# EAGLE board control_board_v006_Rev5 (EAGLE 6.2)
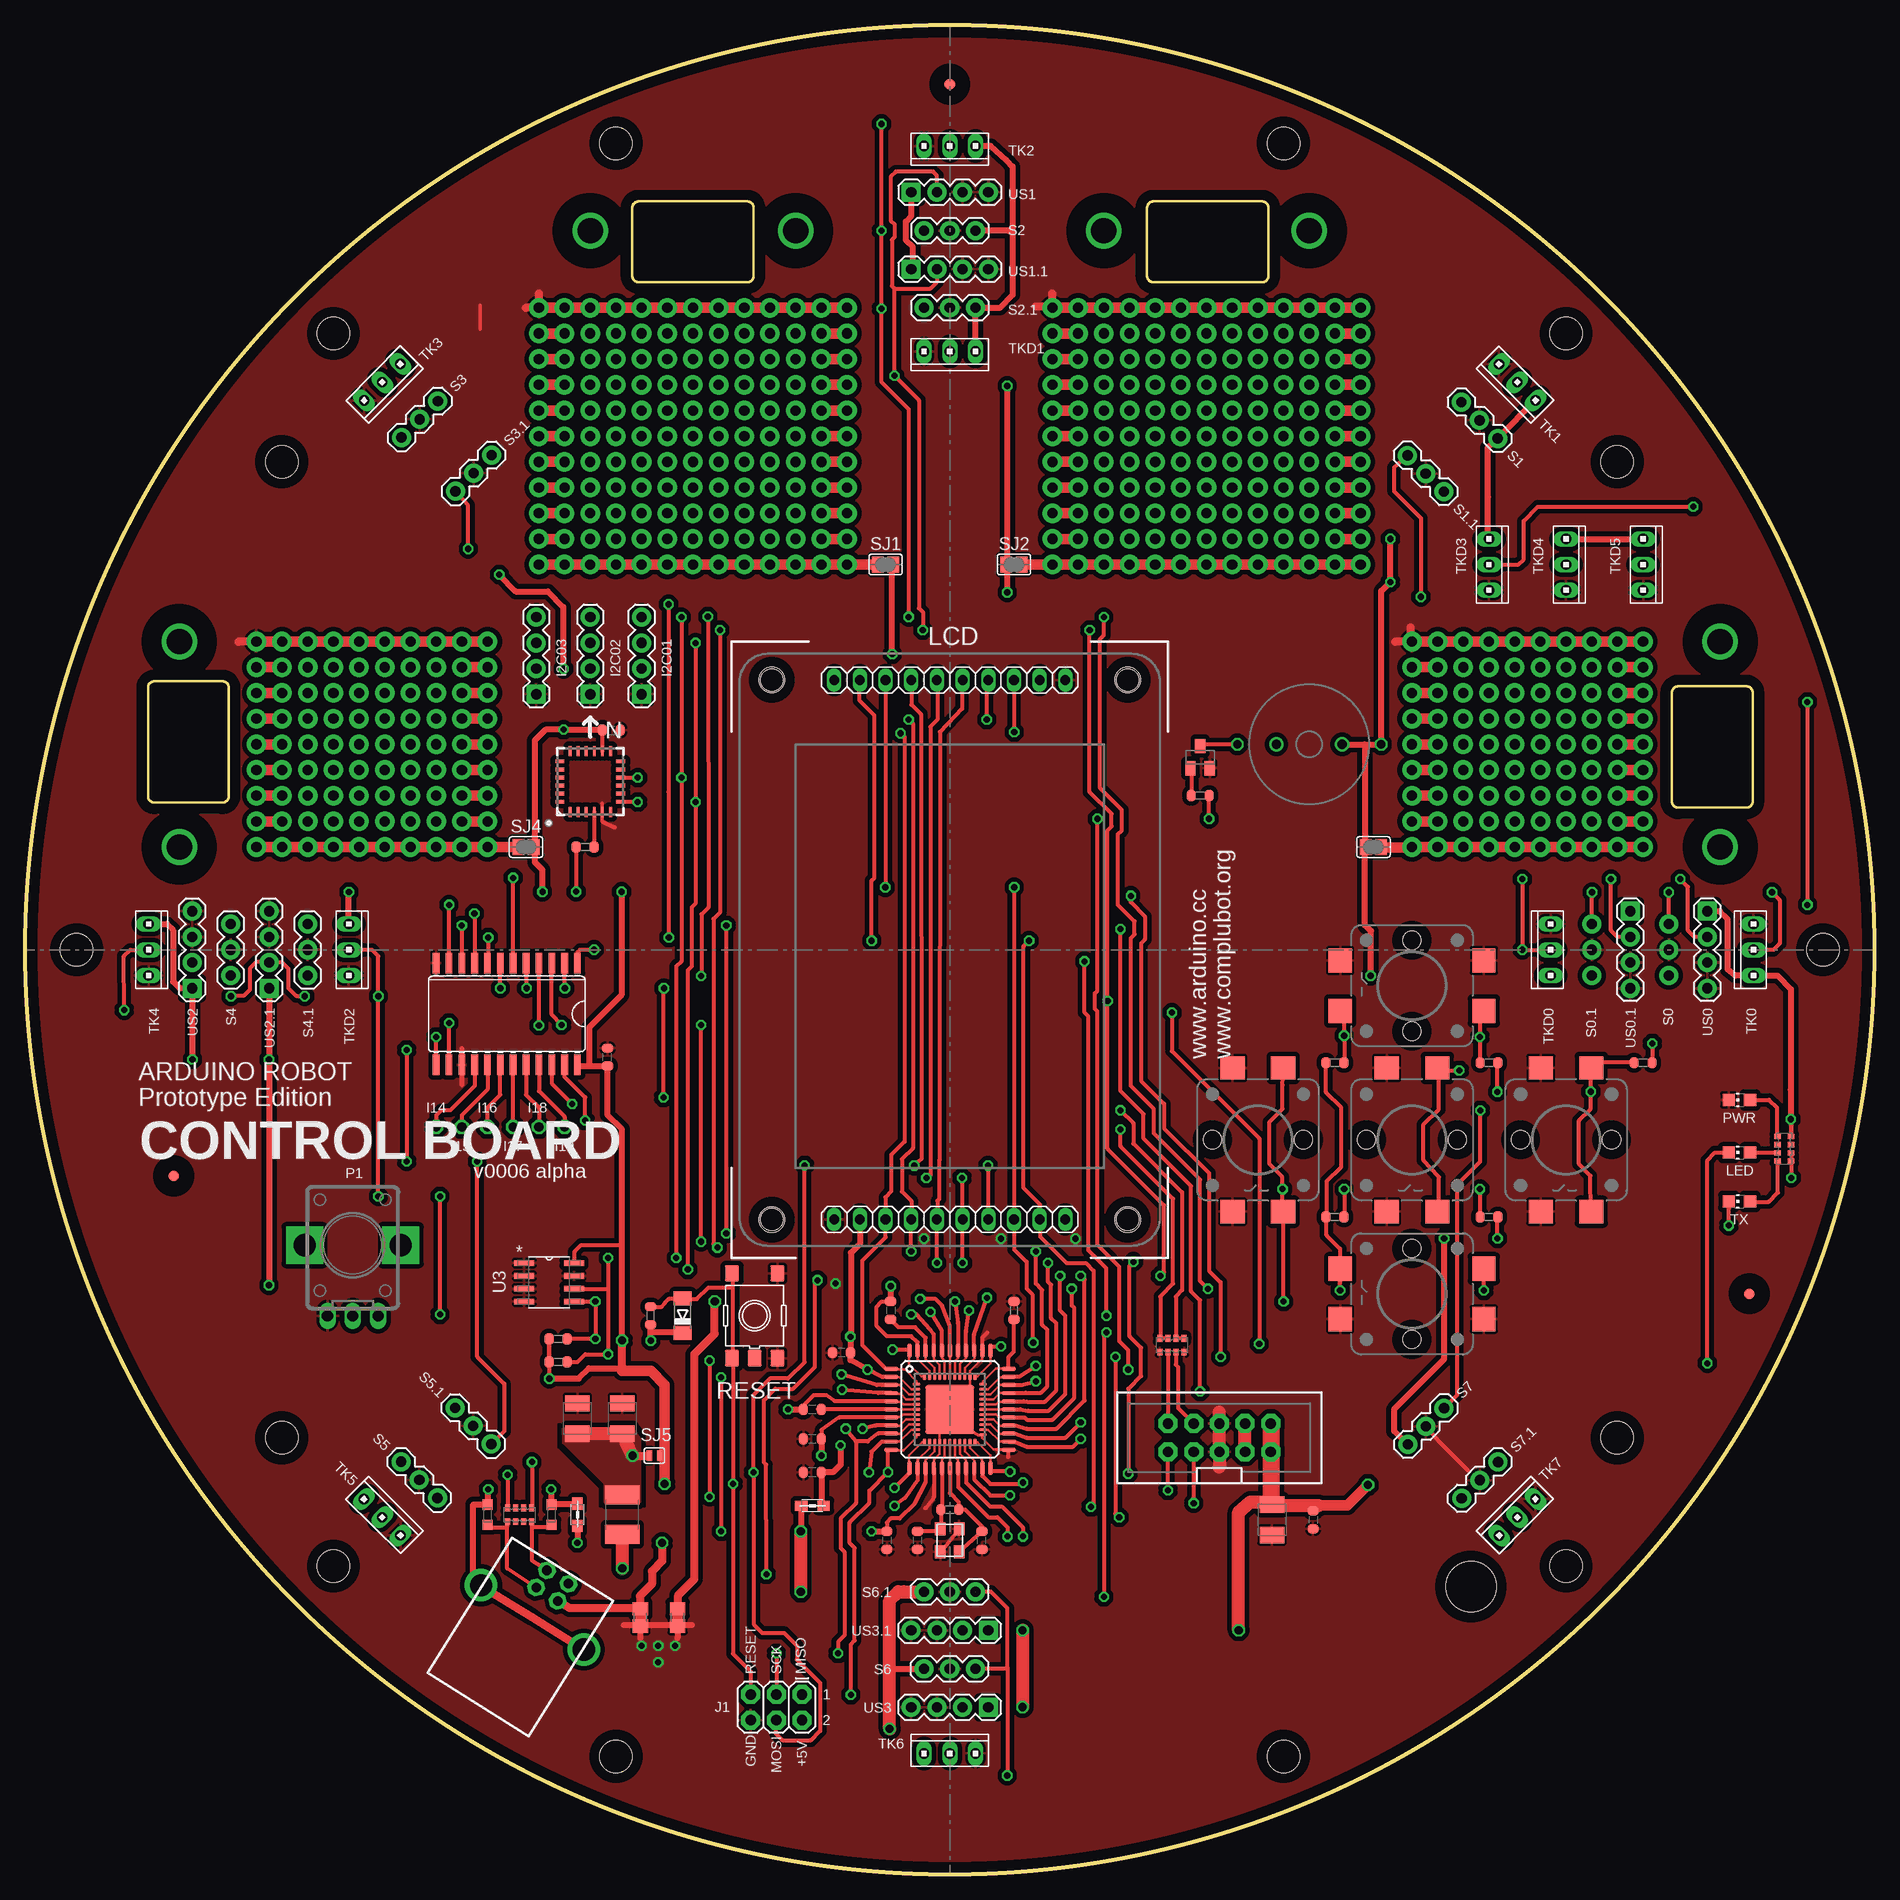
[diagram p1: board, top side]
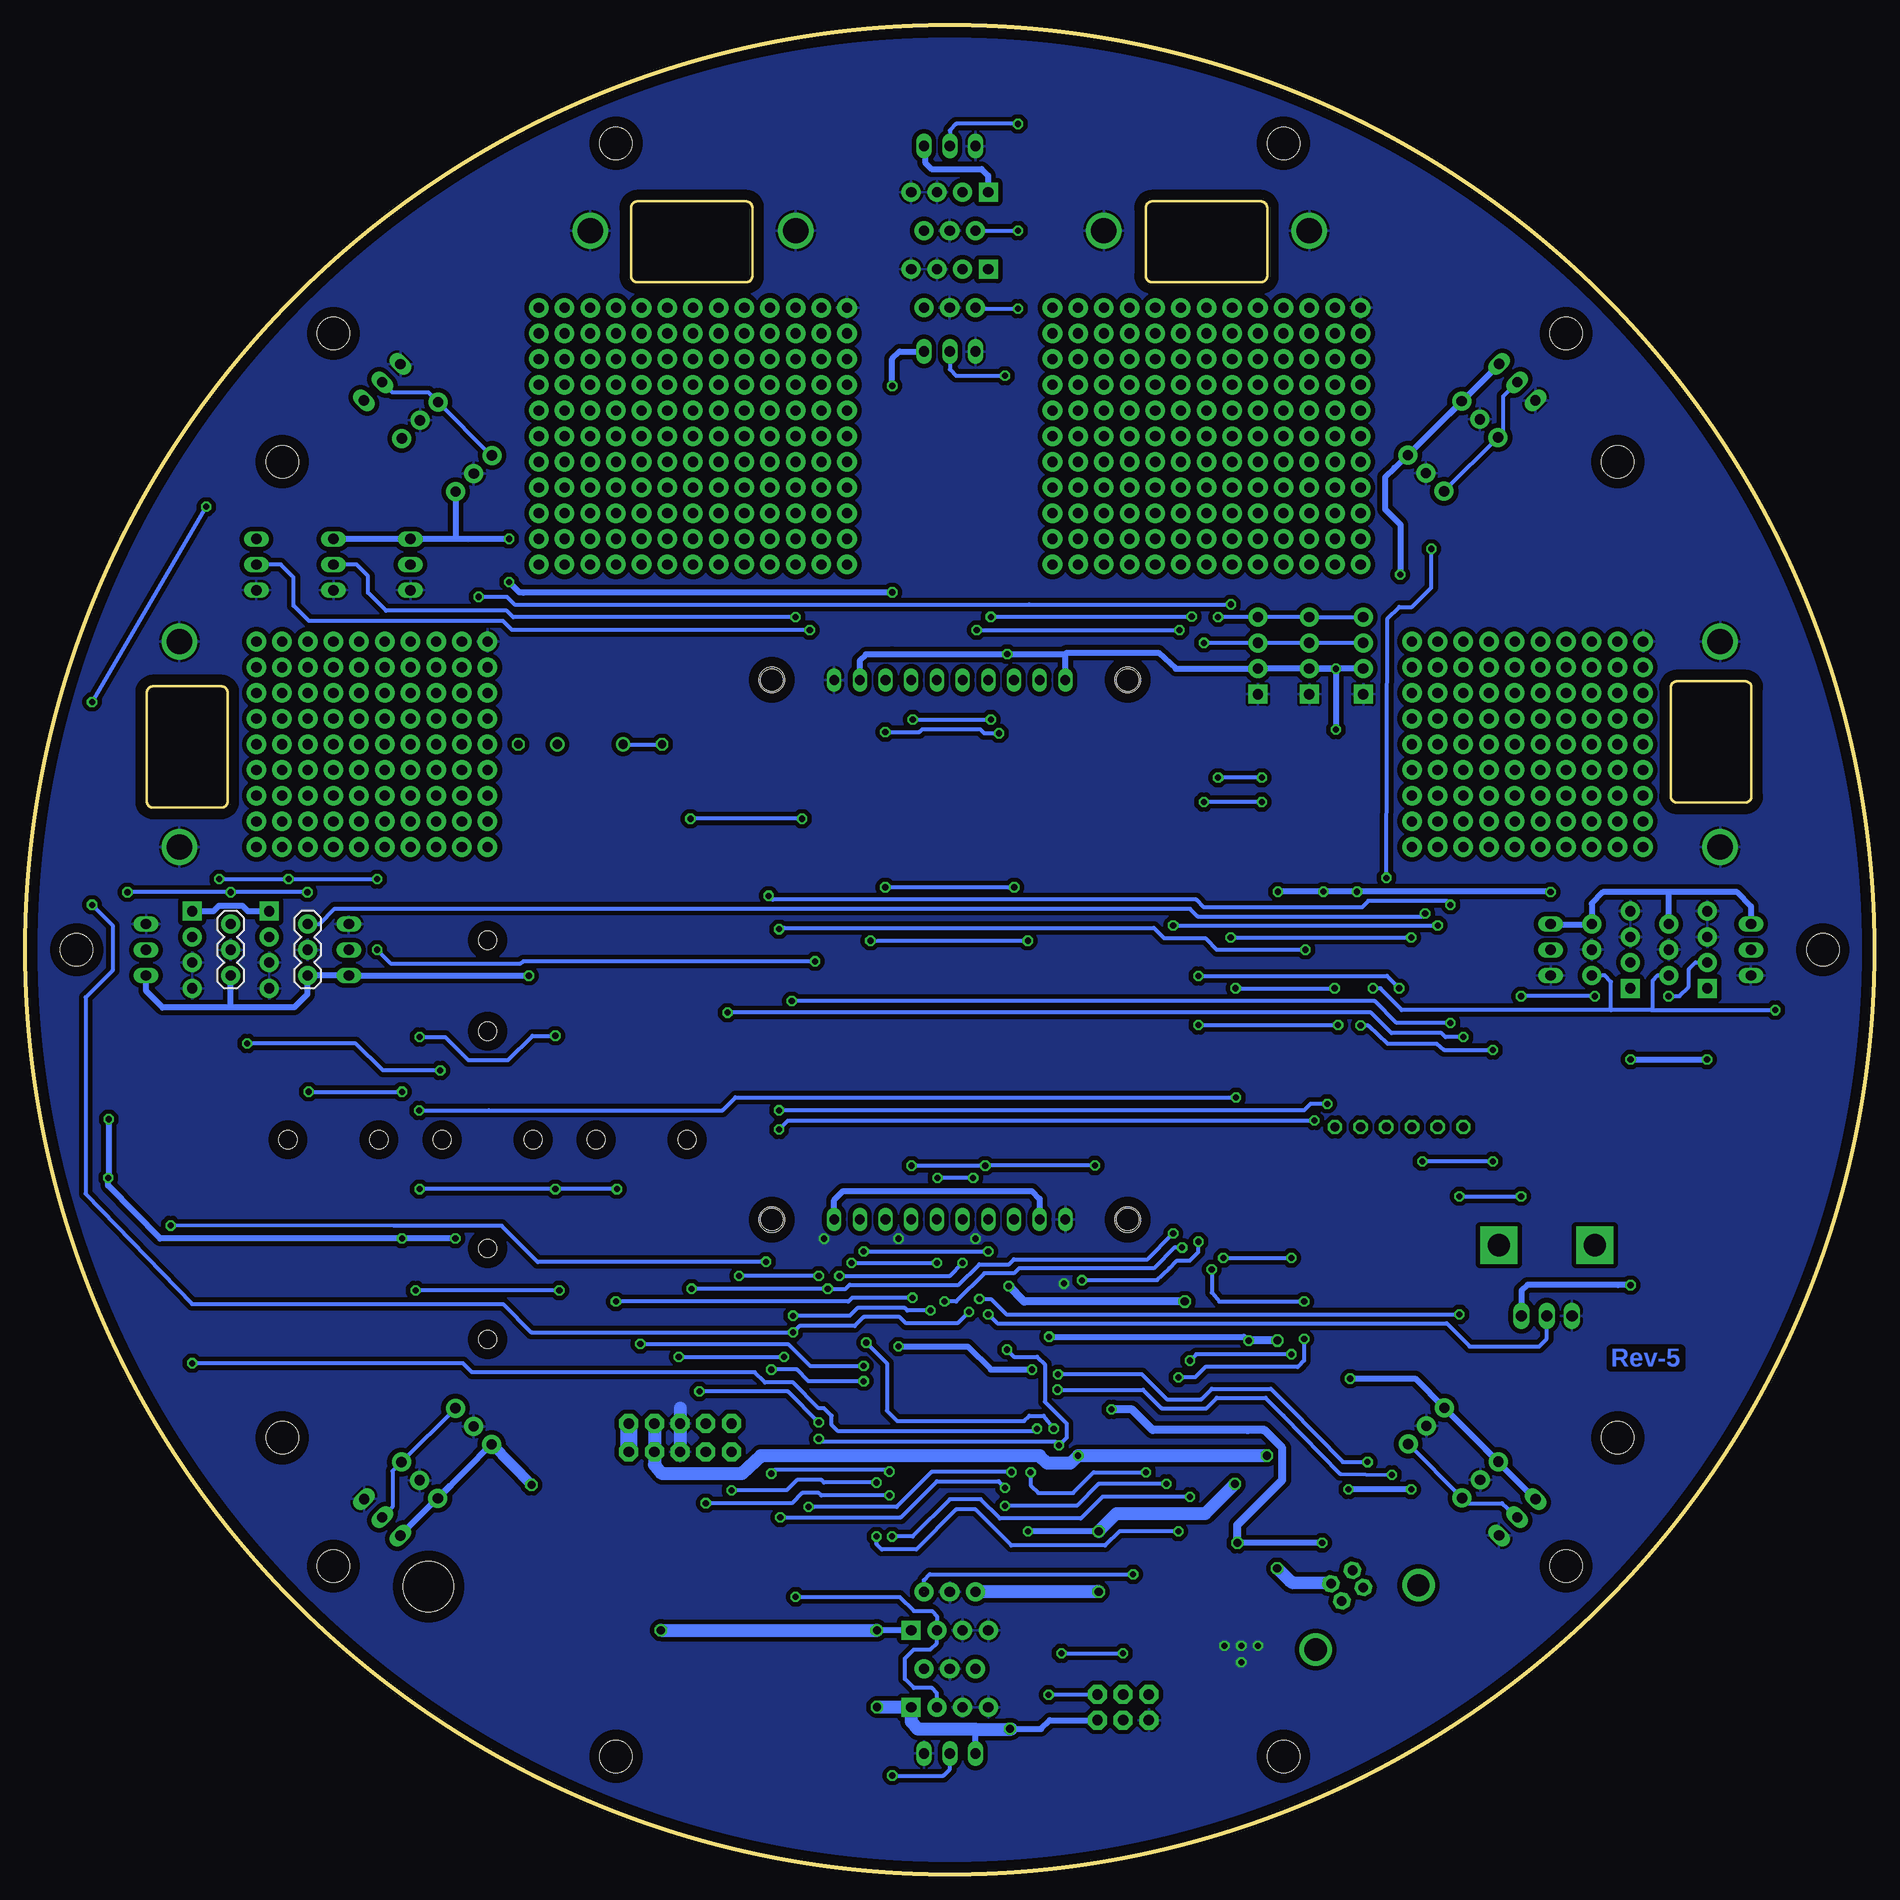
[diagram p2: board, bottom side, seen from below]

Size 182.88 x 182.88 mm. Coordinates in mm from the lower left corner, seen from the top.
Outline: 60.04,164.82 arc-90 60.67,165.46 71.41,165.46 arc-90 72.04,164.82 72.04,158.09 arc-90 71.41,157.46 60.67,157.46 arc-90 60.04,158.09 60.04,164.82
Outline: 111.59,157.46 arc-90 110.96,158.09 110.96,164.82 arc-90 111.59,165.46 122.33,165.46 arc-90 122.96,164.82 122.96,158.09 arc-90 122.33,157.46 111.59,157.46
Outline: 162.87,116.86 arc-90 163.5,117.5 170.23,117.5 arc-90 170.87,116.86 170.87,106.14 arc-90 170.23,105.5 163.5,105.5 arc-90 162.87,106.14 162.87,116.86
Outline: 12.13,117.36 arc-90 12.77,118 19.5,118 arc-90 20.14,117.36 20.14,106.64 arc-90 19.5,106 12.77,106 arc-90 12.13,106.64 12.13,117.36
Outline: circle at 91.44,91.44 radius 91.42
Copper layers (1*16): Top 0.035mm / dielectric 1.5mm / Bottom 0.035mm
Design rules: minimum track width 10mil, minimum drill 23mil, track to track 10mil, track to pad 10mil, pad to pad 10mil, via to via 10mil, smd to smd 7mil, copper to edge 40mil, drill to drill 8mil, minimum pad ring 10mil, minimum via ring 8mil, stop-mask expansion 2mil, vias tented up to drill 30mil, thermal gap 10mil
Net classes: 0 default: width 0.254 mm, drill 0.584 mm, clearance 0.178 mm; 1 +5V: width 0.254 mm, drill 0.787 mm, clearance 0.178 mm; 2 gnd: width 0.254 mm, drill 0.584 mm, clearance 0.178 mm
Holes 2.5 mm at 109.04,64.74 73.84,64.74 73.84,118.14 109.04,118.14
Holes 5 mm at 143,28.45
tRestrict: area 93.2,33.7 to 93.6,34.8; area 95.4,42.5 to 95.8,43.2

## Footprints (pad centres in the part's own frame; a part is rotated, then mirrored left to right if it is on the bottom)
FIDUCIA-MOUNT = smd 1.016 x 1.016: P$1 0,0
C0603-ROUND = smd 0.898 x 1.1: 1 -0.889,0; 2 0.889,0
SMC_B = smd 1.6 x 2.4: + -1.5,0; - 1.5,0
MINIMELF = smd 1.4 x 1.8: A 1.7,0; C -1.7,0
L1812 = smd 1.9 x 3.4: 1 -1.95,0; 2 1.95,0
BASE_ROBOT_001 = hole 3.2: 5.08,91.44; 152.4,152.4; 30.48,152.4; 177.8,91.44; 30.48,30.48; 152.4,30.48; 58.42,171.196; 124.46,171.196; 58.42,11.659; 124.46,11.659; 25.375,139.7; 25.375,43.18; 157.455,139.7; 157.455,43.18
2.5PAD = drill 2.5 pad 3.5: P$1 0,0
1X04 = drill 1.016 pad 1.88 square: 1 0,0 | drill 1.016 pad 1.88: 2 2.54,0; 3 5.08,0; 4 7.62,0
SO24W = smd 0.66 x 2.032: 1 -6.985,-5.029; 2 -5.715,-5.029; 3 -4.445,-5.029; 4 -3.175,-5.029; 5 -1.905,-5.029; 6 -0.635,-5.029; 7 0.635,-5.029; 8 1.905,-5.029; 9 3.175,-5.029; 10 4.445,-5.029; 11 5.715,-5.029; 12 6.985,-5.029; 13 6.985,5.029; 14 5.715,5.029; 15 4.445,5.029; 16 3.175,5.029; 17 1.905,5.029; 18 0.635,5.029; 19 -0.635,5.029; 20 -1.905,5.029; 21 -3.175,5.029; 22 -4.445,5.029; 23 -5.715,5.029; 24 -6.985,5.029
HMC6352 = smd 1 x 0.4: 1 -3,2; 2 -3,1.2; 3 -3,0.4; 4 -3,-0.4; 5 -3,-1.2; 6 -3,-2; 13 3,-2; 14 3,-1.2; 15 3,-0.4; 16 3,0.4; 17 3,1.2; 18 3,2 | smd 0.4 x 1: 7 -2,-3; 8 -1.2,-3; 9 -0.4,-3; 10 0.4,-3; 11 1.2,-3; 12 2,-3; 19 2,3; 20 1.2,3; 21 0.4,3; 22 -0.4,3; 23 -1.2,3; 24 -2,3
2X3 = drill 1.016 pad 1.88 octagon: 1 0,0; 2 0,2.54; 3 2.54,0; 4 2.54,2.54; 5 5.08,0; 6 5.08,2.54
1X10-TH = drill 0.95 pad 1.422 long: 1 -11.43,0; 2 -8.89,0; 3 -6.35,0; 4 -3.81,0; 5 -1.27,0; 6 1.27,0; 7 3.81,0; 8 6.35,0; 9 8.89,0; 10 11.43,0
2X5-SHROUDED_LOCK = drill 1.016 pad 1.88 octagon: 1 -1.397,5.08; 2 1.397,5.08; 3 -1.397,2.54; 4 1.397,2.54; 5 -1.397,0; 6 1.397,0; 7 -1.397,-2.54; 8 1.397,-2.54; 9 -1.397,-5.08; 10 1.397,-5.08
0805 = smd 1.2 x 1: 1 -1.1,0; 2 1.1,0
WUERTH-ELEKTRONIK_0805 = smd 1.2 x 1: 1 -1.1,0; 2 1.1,0
1.8-LCD = hole 2.2: -26.67,17.607; -26.67,-17.607; 26.67,17.607; 26.67,-17.607
CHIP-LED0805 = smd 1.2 x 1.2: A 0,-1.05; C 0,1.05
R0805 = smd 1.3 x 1.5: 1 -0.85,0; 2 0.85,0
POT-V = drill 1.1 long: A -2.5,-7; B 2.5,-7; C 0,-7 | drill 2.2 pad 3.683 square: P$4 4.75,0; P$5 -4.75,0
PADS_LOTTIE_LEMON_SUP = drill 1 pad 1.93: P$1 -2.54,-12.7; P$2 -2.54,-15.24; P$3 -2.54,-17.78; P$4 -2.54,-20.32; P$5 -2.54,-22.86; P$6 -2.54,-25.4; P$7 -2.54,-27.94; P$8 -5.08,-12.7; P$9 -5.08,-15.24; P$10 -5.08,-17.78; P$11 -5.08,-20.32; P$12 -5.08,-22.86; P$13 -5.08,-25.4; P$14 -5.08,-27.94; P$15 -7.62,-12.7; P$16 -7.62,-15.24; P$17 -7.62,-17.78; P$18 -7.62,-22.86; P$19 -7.62,-20.32; P$20 -7.62,-27.94; P$21 -7.62,-25.4; P$22 -10.16,-12.7; P$23 -10.16,-15.24; P$24 -10.16,-17.78; P$25 -10.16,-10.16; P$26 -12.7,-10.16; P$27 -15.24,-10.16; P$28 -17.78,-10.16; P$30 -20.32,-10.16; P$31 -20.32,-12.7; P$42 2.54,-7.62; P$46 2.54,-10.16; P$47 2.54,-12.7; P$48 2.54,-15.24; P$49 2.54,-17.78; P$50 2.54,-22.86; P$51 2.54,-20.32; P$52 2.54,-27.94; P$53 2.54,-25.4; P$55 0,-7.62; P$57 0,-10.16; P$58 0,-12.7; P$59 0,-15.24; P$60 0,-17.78; P$61 0,-20.32; P$62 0,-22.86; P$63 0,-25.4; P$64 0,-27.94; P$91 -10.16,-20.32; P$105 -10.16,-22.86; P$108 -2.54,-7.62; P$111 -2.54,-10.16; P$112 -10.16,-25.4; P$115 -5.08,-7.62; P$120 -7.62,-7.62; P$123 -10.16,-27.94; P$126 -10.16,-7.62; P$129 -12.7,-12.7; P$132 -12.7,-7.62; P$135 -12.7,-15.24; P$138 -15.24,-7.62; P$141 -12.7,-17.78; P$144 -17.78,-7.62; P$147 -12.7,-20.32; P$150 -20.32,-7.62; P$152 -12.7,-22.86; P$156 -5.08,-10.16; P$157 -7.62,-10.16; P$158 -12.7,-25.4; P$159 -12.7,-27.94; P$160 -15.24,-12.7; P$161 -15.24,-15.24; P$162 -15.24,-17.78; P$163 -15.24,-20.32; P$164 -15.24,-22.86; P$165 -15.24,-25.4; P$166 -15.24,-27.94; P$167 -17.78,-15.24; P$168 -17.78,-12.7; P$169 -17.78,-17.78; P$170 -17.78,-20.32; P$171 -17.78,-22.86; P$172 -17.78,-25.4; P$173 -17.78,-27.94; P$174 -20.32,-15.24; P$175 -20.32,-17.78; P$176 -20.32,-20.32; P$177 -20.32,-22.86; P$178 -20.32,-25.4; P$179 -20.32,-27.94
PADS_LOTTIE_LEMON_SUP' = drill 1 pad 1.93: P$1 -2.54,-12.7; P$2 -2.54,-15.24; P$3 -2.54,-17.78; P$4 -2.54,-20.32; P$5 -2.54,-22.86; P$6 -2.54,-25.4; P$7 -2.54,-27.94; P$8 -5.08,-12.7; P$9 -5.08,-15.24; P$10 -5.08,-17.78; P$11 -5.08,-20.32; P$12 -5.08,-22.86; P$13 -5.08,-25.4; P$14 -5.08,-27.94; P$15 -7.62,-12.7; P$16 -7.62,-15.24; P$17 -7.62,-17.78; P$18 -7.62,-22.86; P$19 -7.62,-20.32; P$20 -7.62,-27.94; P$21 -7.62,-25.4; P$22 -10.16,-12.7; P$23 -10.16,-15.24; P$24 -10.16,-17.78; P$25 -10.16,-10.16; P$26 -12.7,-10.16; P$27 -15.24,-10.16; P$28 -17.78,-10.16; P$29 -20.32,-7.62; P$30 -20.32,-10.16; P$31 -20.32,-12.7; P$42 10.16,-2.54; P$43 10.16,-5.08; P$44 7.62,-7.62; P$45 10.16,-7.62; P$46 10.16,-10.16; P$47 10.16,-12.7; P$48 10.16,-15.24; P$49 10.16,-17.78; P$50 10.16,-22.86; P$51 10.16,-20.32; P$52 10.16,-27.94; P$53 10.16,-25.4; P$55 7.62,-2.54; P$56 7.62,-5.08; P$57 7.62,-10.16; P$58 7.62,-12.7; P$59 7.62,-15.24; P$60 7.62,-17.78; P$61 7.62,-20.32; P$62 7.62,-22.86; P$63 7.62,-25.4; P$64 7.62,-27.94; P$67 5.08,-2.54; P$68 5.08,-5.08; P$69 5.08,-7.62; P$70 5.08,-10.16; P$71 5.08,-12.7; P$72 5.08,-15.24; P$73 5.08,-17.78; P$74 5.08,-20.32; P$75 5.08,-22.86; P$76 5.08,-25.4; P$77 5.08,-27.94; P$80 2.54,-2.54; P$81 2.54,-5.08; P$82 2.54,-7.62; P$83 2.54,-10.16; P$84 2.54,-12.7; P$85 2.54,-15.24; P$86 2.54,-17.78; P$87 2.54,-20.32; P$88 2.54,-22.86; P$89 2.54,-25.4; P$90 2.54,-27.94; P$91 -10.16,-20.32; P$94 0,-2.54; P$95 0,-5.08; P$96 0,-10.16; P$97 0,-7.62; P$98 0,-15.24; P$99 0,-12.7; P$100 0,-17.78; P$101 0,-20.32; P$102 0,-22.86; P$103 0,-25.4; P$104 0,-27.94; P$105 -10.16,-22.86; P$108 -2.54,-2.54; P$109 -2.54,-5.08; P$110 -2.54,-7.62; P$111 -2.54,-10.16; P$112 -10.16,-25.4; P$115 -5.08,-2.54; P$116 -5.08,-5.08; P$117 -5.08,-7.62; P$118 -7.62,-7.62; P$119 -7.62,-5.08; P$120 -7.62,-2.54; P$123 -10.16,-27.94; P$124 -10.16,-7.62; P$125 -10.16,-5.08; P$126 -10.16,-2.54; P$129 -12.7,-12.7; P$130 -12.7,-7.62; P$131 -12.7,-5.08; P$132 -12.7,-2.54; P$135 -12.7,-15.24; P$136 -15.24,-7.62; P$137 -15.24,-5.08; P$138 -15.24,-2.54; P$141 -12.7,-17.78; P$142 -17.78,-7.62; P$143 -17.78,-5.08; P$144 -17.78,-2.54; P$147 -12.7,-20.32; P$150 -20.32,-2.54; P$151 -20.32,-5.08; P$152 -12.7,-22.86; P$156 -5.08,-10.16; P$157 -7.62,-10.16; P$158 -12.7,-25.4; P$159 -12.7,-27.94; P$160 -15.24,-12.7; P$161 -15.24,-15.24; P$162 -15.24,-17.78; P$163 -15.24,-20.32; P$164 -15.24,-22.86; P$165 -15.24,-25.4; P$166 -15.24,-27.94; P$167 -17.78,-15.24; P$168 -17.78,-12.7; P$169 -17.78,-17.78; P$170 -17.78,-20.32; P$171 -17.78,-22.86; P$172 -17.78,-25.4; P$173 -17.78,-27.94; P$174 -20.32,-15.24; P$175 -20.32,-17.78; P$176 -20.32,-20.32; P$177 -20.32,-22.86; P$178 -20.32,-25.4; P$179 -20.32,-27.94
R0603-ROUND = smd 0.898 x 1.1: 1 -0.889,0; 2 0.889,0
CT/CN0603 = smd 1 x 1: 1 -1,0; 2 1,0
CAY16 = smd 0.5 x 0.65: 1 -1.2,-0.675; 2 -0.4,-0.675; 3 0.4,-0.675; 4 1.2,-0.675; 5 1.2,0.675; 6 0.4,0.675; 7 -0.4,0.675; 8 -1.2,0.675
1X03 = drill 1.016 pad 1.88: 1 0,0; 2 2.54,0; 3 5.08,0
TS42 = smd 1.6 x 1.4: 1 -4.2,2.25; 2 4.2,2.25; 3 -4.2,-2.25; 4 4.2,-2.25; 5 -4.2,0
TACTILE-SMD-12MM = smd 2.3 x 2.4: P$1 7.1,-2.5; P$2 -7.1,-2.5; P$3 7.1,2.5; P$4 -7.1,2.5 | hole 1.8: 0,4.5; 0,-4.5
BUZZER-12MM-NS = drill 0.9: + 3.25,0; - -3.25,0
SJ = smd 1.168 x 1.6: 1 -0.762,0; 2 0.762,0
SJL = smd 0.508 x 1.016: 1 -0.508,0; 2 0.508,0
SOT23 = smd 1 x 1.4: 1 -0.95,-1.1; 2 0.95,-1.1; 3 0,1.1
10X03MTA = drill 1.016 long: 1 2.54,0; 2 0,0; 3 -2.54,0
TQFP44-PAD = smd 1.4 x 0.45: 1 -5.8,4; 2 -5.8,3.2; 3 -5.8,2.4; 4 -5.8,1.6; 5 -5.8,0.8; 6 -5.8,0; 7 -5.8,-0.8; 8 -5.8,-1.6; 9 -5.8,-2.4; 10 -5.8,-3.2; 11 -5.8,-4; 23 5.8,-4; 24 5.8,-3.2; 25 5.8,-2.4; 26 5.8,-1.6; 27 5.8,-0.8; 28 5.8,0; 29 5.8,0.8; 30 5.8,1.6; 31 5.8,2.4; 32 5.8,3.2; 33 5.8,4 | smd 0.45 x 1.4: 12 -4,-5.8; 13 -3.2,-5.8; 14 -2.4,-5.8; 15 -1.6,-5.8; 16 -0.8,-5.8; 17 0,-5.8; 18 0.8,-5.8; 19 1.6,-5.8; 20 2.4,-5.8; 21 3.2,-5.8; 22 4,-5.8; 34 4,5.8; 35 3.2,5.8; 36 2.4,5.8; 37 1.6,5.8; 38 0.8,5.8; 39 0,5.8; 40 -0.8,5.8; 41 -1.6,5.8; 42 -2.4,5.8; 43 -3.2,5.8; 44 -4,5.8 | smd 1 x 1: P$1 0,0
QFN44ML7X7 = smd 0.75 x 0.3: 1 -3.275,2.5; 2 -3.275,2; 3 -3.275,1.5; 4 -3.275,1; 5 -3.275,0.5; 6 -3.275,0; 7 -3.275,-0.5; 8 -3.275,-1; 9 -3.275,-1.5; 10 -3.275,-2; 11 -3.275,-2.5; 23 3.275,-2.5; 24 3.275,-2; 25 3.275,-1.5; 26 3.275,-1; 27 3.275,-0.5; 28 3.275,0; 29 3.275,0.5; 30 3.275,1; 31 3.275,1.5; 32 3.275,2; 33 3.275,2.5 | smd 0.3 x 0.75: 12 -2.5,-3.275; 13 -2,-3.275; 14 -1.5,-3.275; 15 -1,-3.275; 16 -0.5,-3.275; 17 0,-3.275; 18 0.5,-3.275; 19 1,-3.275; 20 1.5,-3.275; 21 2,-3.275; 22 2.5,-3.275; 34 2.5,3.275; 35 2,3.275; 36 1.5,3.275; 37 1,3.275; 38 0.5,3.275; 39 0,3.275; 40 -0.5,3.275; 41 -1,3.275; 42 -1.5,3.275; 43 -2,3.275; 44 -2.5,3.275 | smd 4.826 x 4.826: EXP 0,0
SOIC127P600X175-8N = smd 1.981 x 0.559: 1 -2.464,1.905; 2 -2.464,0.635; 3 -2.464,-0.635; 4 -2.464,-1.905; 5 2.464,-1.905; 6 2.464,-0.635; 7 2.464,0.635; 8 2.464,1.905
CRYSTAL-3.2-2.5 = smd 1.3 x 1.05: 1 -1.15,-0.925; 2 1.15,-0.925; 3 1.15,0.925; 4 -1.15,0.925
PN61729 = drill 0.95 pad 1.676 octagon: 1 1.25,4.71; 2 -1.25,4.71; 3 -1.25,2.71; 4 1.25,2.71 | drill 2.2: P$1 -6,0; P$2 6,0

## Placement (x,y rotation side)
1  FIDUCIALMOUNT  [FIDUCIA-MOUNT]  91.44,177.04 0 top
2  FIDUCIALMOUNT  [FIDUCIA-MOUNT]  170.54,57.42 0 top
3  FIDUCIALMOUNT  [FIDUCIA-MOUNT]  14.69,69.08 0 top
C1  100n  [C0603-ROUND]  85.6,55.75 270 top
C2  22p  [C0603-ROUND]  88.27,33.02 90 top
C3  22p  [C0603-ROUND]  94.61,33.02 90 top
C4  100n  [C0603-ROUND]  80.72,51.59 180 top
C5  1uF/10v  [C0603-ROUND]  77.85,45.97 180 top
C6  1uF/10v  [C0603-ROUND]  77.85,39.75 180 top
C7  22uF/10v  [SMC_B]  59.05,45.09 90 top
C8  22uF/10v  [SMC_B]  54.61,45.09 90 top
C9  100n  [C0603-ROUND]  77.85,43.05 180 top
C10  22uF/10v  [SMC_B]  123.32,35.05 270 top
C11  100n  [C0603-ROUND]  127.38,35.05 270 top
C12  100n  [C0603-ROUND]  85.22,33.02 270 top
C13  100n  [C0603-ROUND]  57.58,80.82 90 top
C16  100n  [C0603-ROUND]  57.96,113.16 0 top
D1  CD1206  [MINIMELF]  65.02,55.24 90 top
F1  500mA  [L1812]  59.05,35.56 90 top
G1  LOTTIE_LEMON_BASE_TYPE  [BASE_ROBOT_001]  0,0 0 top
H1  2.5-MOUNTING-HOLE  [2.5PAD]  15.24,121.92 0 top
H2  2.5-MOUNTING-HOLE  [2.5PAD]  15.24,101.6 0 top
H3  2.5-MOUNTING-HOLE  [2.5PAD]  167.64,121.92 0 top
H4  2.5-MOUNTING-HOLE  [2.5PAD]  106.68,162.56 180 top
H5  2.5-MOUNTING-HOLE  [2.5PAD]  127,162.56 180 top
H6  2.5-MOUNTING-HOLE  [2.5PAD]  55.88,162.56 0 top
H7  2.5-MOUNTING-HOLE  [2.5PAD]  76.2,162.56 0 top
H8  2.5-MOUNTING-HOLE  [2.5PAD]  167.64,101.6 0 top
I2C01  [1X04]  60.96,116.71 90 top
I2C02  [1X04]  55.88,116.71 90 top
I2C03  [1X04]  50.55,116.71 90 top
IC1  74HC4067D  [SO24W]  47.62,85.09 180 top
IC4  HMC6352  [HMC6352]  55.88,108.08 90 top
J1  MOLEX - 90130-3206 - HEADER, RIGHT ANGLE, 2ROW, 6WAY  [2X3]  76.83,17.78 180 top
JP1  DISPLAY  [1X10-TH]  91.44,118.11 0 top
JP2  DISPLAY  [1X10-TH]  91.44,64.77 0 top
JP3  MULTICOMP - MC9A12-1034 - HEADER, STRAIGHT  [2X5-SHROUDED_LOCK]  118.11,43.18 90 top
L1  MH2029-300Y  [0805]  77.85,36.45 180 top
L2  MH2029-300Y  [WUERTH-ELEKTRONIK_0805]  54.61,35.56 270 top
LCD  1.8 inch DISPLAY & SD_CARD  [1.8-LCD]  91.44,91.44 270 top
LED  YELLOW  [CHIP-LED0805]  169.54,71.37 90 top
NM1  NM  [R0805]  60.83,25.4 90 top
NM2  NM  [R0805]  64.52,25.4 270 top
P1  10K  [POT-V]  32.38,62.23 0 top
PTZ1  [PADS_LOTTIE_LEMON_SUP]  139.7,93.98 180 top
PTZ2  [PADS_LOTTIE_LEMON_SUP]  25.4,93.98 180 top
PTZ3  [PADS_LOTTIE_LEMON_SUP']  60.96,127 180 top
PTZ4  [PADS_LOTTIE_LEMON_SUP']  111.76,127 180 top
PWR  [CHIP-LED0805]  169.54,76.58 90 top
R3  10K  [R0603-ROUND]  61.85,55.24 90 top
R4  2K  [R0603-ROUND]  116.2,106.68 0 top
R5  1M  [R0603-ROUND]  91.44,36.07 0 top
R6  10K  [R0603-ROUND]  97.79,55.75 270 top
R7  VARISTORCN0603  [CT/CN0603]  45.72,35.56 90 top
R8  VARISTORCN0603  [CT/CN0603]  52.07,35.56 90 top
R9  2K  [R0603-ROUND]  52.7,52.96 180 top
R10  2K  [R0603-ROUND]  52.7,50.67 0 top
R11  10K  [R0603-ROUND]  55.37,101.6 0 top
R_S1  2k  [R0603-ROUND]  144.78,65.02 0 top
R_S2  330  [R0603-ROUND]  129.54,65.02 0 top
R_S3  620  [R0603-ROUND]  129.54,80.26 180 top
R_S4  1k  [R0603-ROUND]  144.78,80.26 180 top
R_S5  3k3  [R0603-ROUND]  160.02,80.26 180 top
RN1  22R  [CAY16]  48.9,35.56 180 top
RN2  1K  [CAY16]  173.99,71.75 270 top
RN3  10K  [CAY16]  113.41,52.32 180 top
S0  [1X03]  162.56,93.98 270 bottom
S0.1  [1X03]  154.94,93.98 270 bottom
S1  [1X03]  142.05,145.61 315 top
S1.1  [1X03]  136.72,140.34 315 top
S2  [1X03]  88.9,162.56 0 top
S2.1  [1X03]  88.9,154.94 0 top
S3  [1X03]  37.21,142.11 45 top
S3.1  [1X03]  42.55,136.78 45 top
S4  [1X03]  20.32,88.9 90 top
S4.1  [1X03]  27.94,88.9 90 top
S5  [1X03]  40.77,37.21 135 top
S5.1  [1X03]  46.1,42.55 135 top
S6  [1X03]  93.98,20.32 180 top
S6.1  [1X03]  93.98,27.94 180 top
S7  [1X03]  140.34,46.1 225 top
S7.1  [1X03]  145.67,40.77 225 top
S8  RESET  [TS42]  72.14,55.24 90 top
S10  1243SHIM-160G-G T&R  [TACTILE-SMD-12MM]  121.92,72.64 270 top
S11  1243SHIM-160G-G T&R  [TACTILE-SMD-12MM]  137.16,57.4 180 top
S12  1243SHIM-160G-G T&R  [TACTILE-SMD-12MM]  137.16,87.88 180 top
S13  1243SHIM-160G-G T&R  [TACTILE-SMD-12MM]  152.4,72.64 270 top
S14  1243SHIM-160GW-G T&R  [TACTILE-SMD-12MM]  137.16,72.64 270 top
SG1  BUZZER1NS  [BUZZER-12MM-NS]  127,111.76 0 top
SJ1  [SJ]  85.09,129.54 180 top
SJ2  [SJ]  97.79,129.54 0 top
SJ3  [SJ]  133.35,101.6 0 top
SJ4  [SJ]  49.53,101.6 180 top
SJ5  [SJL]  62.23,41.4 0 top
T1  BC847  [SOT23]  116.2,110.49 0 top
TK0  [10X03MTA]  170.94,91.44 90 top
TK1  [10X03MTA]  147.57,147.57 135.1 top
TK2  [10X03MTA]  91.44,170.94 180 top
TK3  [10X03MTA]  35.31,147.57 225.1 top
TK4  [10X03MTA]  12.19,91.44 270 top
TK5  [10X03MTA]  35.31,35.31 315.1 top
TK6  [10X03MTA]  91.44,11.94 0 top
TK7  [10X03MTA]  147.57,35.31 45.1 top
TKD0  [10X03MTA]  150.88,91.44 90 top
TKD1  [10X03MTA]  91.44,150.62 180 top
TKD2  [10X03MTA]  32,91.44 270 top
TKD3  [10X03MTA]  144.78,129.54 270 top
TKD4  [10X03MTA]  152.4,129.54 270 top
TKD5  [10X03MTA]  160.02,129.54 270 top
TX  RED  [CHIP-LED0805]  169.54,66.55 90 top
U1  ATMEGA32U4-AU  [TQFP44-PAD]  91.46,45.99 0 top
U2  ATMEGA32U4-MU  [QFN44ML7X7]  91.44,45.97 0 top
U3  AT24C512C-SSHD-B  [SOIC127P600X175-8N]  51.82,58.55 0 top
US0  [1X04]  166.37,95.25 270 top
US0.1  [1X04]  158.75,95.25 270 top
US1  [1X04]  87.63,166.37 0 top
US1.1  [1X04]  87.63,158.75 0 top
US2  [1X04]  16.51,87.63 90 top
US2.1  [1X04]  24.13,87.63 90 top
US3  [1X04]  95.25,16.51 180 top
US3.1  [1X04]  95.25,24.13 180 top
X1  16MHz  [CRYSTAL-3.2-2.5]  91.44,33.02 90 top
X2  USB  [PN61729]  50.16,25.4 328 top

## Tracks (layer width: path | path; a pad name or v marks a point on that pad's centre or on a via)
+5V  (via drill 0.6, 0.61, 0.8)
  Top 0.254: U2.14 89.94,41.83 89.05,40.95 U1.14 | U2.34 94.18,49.25 95.45,50.52 U1.34 | U2.2 87.66,47.97 86.49,49.15 85.67,49.17 U1.2
  Top 0.305: U1.34 95.45,52.2 | 95.45,52.2 95.58,52.12 | 95.58,52.12 95.44,52.13 | U1.34 95.46,52.19 95.45,52.2 | 95.58,52.12 95.56,52.12 95.5,52.2
  Top 0.381: IC4.14 C16.1
  Top 0.406: v145.62,62.89 145.62,64.92 | v83.31,49.91 84.75,49.19 84.89,49.17 85.67,49.17 | 95.47,52.17 95.5,52.2 v96.52,52.2 | 89.05,40.22 89.05,40.13 | 89.05,40.13 89.05,38.76 88.52,37.72 87.88,36.58 86.49,35.18 85.6,35.18 85.22,34.8 C12.1 | 174.68,70.57 v174.68,68.89 174.68,68.83 | U1.14 89.06,40.14 89.05,40.13 | 86.97,27.91 86.87,27.94 | U3.8 54.36,60.45 54.36,61.59 54.99,62.23 59.03,62.23 | R10.1 R9.2 51.82,48.9 | 86.36,27.94 86.36,28.07 | 82.55,64.64 JP2.2 | 174.68,74.62 174.68,73.02 174.66,73.01 RN2.8 174.66,74.64 | 174.68,70.57 174.68,71.29 174.66,71.3 RN2.6 | 174.68,70.57 RN2.5 | R11.1 v54.48,97.18 | SJ5.2 63.25,41.66 | 123.72,36.47 123.62,36.85 C10.+
  Top 0.61: 145.62,64.92 R_S1.2 | 123.83,36.6 C10.+ 123.72,36.81 123.7,36.83 | 85.5,20.4 85.8,20.32 S6.3 | 88.85,27.89 S6.1.3 | IC1.24 54.63,79.93 56.01,79.93 | 56.01,79.93 57.3,79.93 C13.1 57.58,75.11 59.03,73.71 59.03,62.23 v59.03,52.78 | 61.77,54.46 R3.1 | 65.02,53.65 D1.C 65.43,53.57 61.85,53.57 | 61.87,54.33 R3.1 | 61.62,54.3 R3.1 | 81.61,53.19 v81.61,53.16 | TKD4.3 TKD5.3 | TKD3.3 144.68,132.08 144.68,136.25 144.65,136.91 144.65,141.1 S1.3 145.64,142.05 TK1.3 | 132.49,111.76 132.49,101.6 | SG1.+ 132.49,111.76 | v174.62,74.68 174.62,77.6 174.63,87.56 173.33,88.88 171.09,88.88 TK0.3 170.94,88.88 169.14,88.88 168.38,89.51 168.38,94.46 167.62,95.22 166.62,95.22 US0.1 | v174.62,74.68 174.68,74.62 | 132.49,101.6 132.49,93.88 133.1,93.29 v133.07,88.88 | 132.49,101.6 SJ3.1 | 132.49,111.76 v134.11,111.76 134.14,111.76 134.14,112.14 134.11,125.73 134.11,126.92 v135.03,127.81 v135.03,132.08 135.03,132.1 | v24.11,58.27 v24.11,80.59 24.11,87.38 US2.1.1 | v16.54,80.59 16.54,87.38 US2.1 16.26,87.66 15.27,87.66 14.63,88.29 14.63,93.37 13.99,94 12.22,94 | 12.22,94 12.19,93.88 TK4.3 12.22,94 | v51.16,97.18 51.16,99.34 50.42,100.08 50.39,101.6 | TKD2.3 v32,97.16 | US1.1 87.66,166.09 87.66,164.03 87.1,163.47 87.1,161.65 87.78,160.96 87.78,158.9 US1.1.1 | TKD1.3 94,150.77 94,154.84 S2.1.3 94,154.86 94,154.94 96.39,154.94 97.66,156.21 97.66,162.43 | S2.3 97.59,162.56 97.38,162.51 97.59,162.51 97.66,162.43 | TK2.3 95.5,170.94 97.03,169.54 97.66,168.91 97.66,162.43 | v85.75,120.67 85.75,129.24 SJ1.1 | v97.13,126.8 97.13,129.24 SJ2.1 97.13,129.64 v97.13,147.22 | v46.89,128.55 46.86,128.52 48.51,126.87 51.69,126.87 53.21,125.35 53.21,119.25 v53.24,119.23
  Top 0.61: 50.39,101.6 50.39,112.14 51.46,113.21 v53.24,113.21 53.29,113.16 C16.1 | 50.39,101.6 SJ4.1 | v58.98,97.18 58.98,86.97 55.78,83.77 55.78,79.96 56.01,79.93 | 82.55,64.64 82.55,62.36 81.66,61.47 81.66,53.21 v81.61,53.16 | v61.87,52.78 61.85,52.78 61.85,53.57 | 61.85,53.57 R3.1 | 76.68,33.88 v76.71,33.91 76.75,34.88 L1.2 | v51.84,49.02 51.84,48.79 51.82,48.9 v51.84,49.02 | v51.84,49.02 54.74,49.02 55.75,50.04 59.05,50.04 59.03,50.01 59.03,50.04 | v81.61,53.16 C4.1 81.61,50.85 v83.31,49.91 | v83.69,33.91 C12.1 | v140.34,62.89 140.34,50.93 135.38,45.97 135.38,43.81 135.44,43.81 S7.3 | C11.1 127.38,36.47 | 174.66,74.64 v174.62,74.68
  Top 0.813: 59.03,50.04 v59.03,52.78
  Top 1.016: 127.94,36.47 130.76,36.47 v132.82,38.51 | v63.25,38.61 63.25,41.66 63.25,48.42 61.88,49.78 59.05,49.78 59.03,50.01 | 98.65,16.54 98.55,16.51 98.53,16.51 v98.63,16.54
  Top 1.27: 123.72,36.47 127.38,36.47 127.94,36.47 | v85.5,14.38 85.5,20.4 85.5,27.08 86.36,27.94 86.87,27.94 S6.1.3 | 123.7,36.83 121.16,36.83 120.02,35.81 v120.02,24.13 | v98.65,24.13 98.65,16.54 | v76.71,27.94 v76.71,33.91 | 123.19,36.93 C10.+
  Top 1.676: JP3.10 123.19,36.93
  Bottom 0.406: v61.87,52.78 61.59,52.78
  Bottom 0.61: v140.34,62.89 v145.62,62.89 145.8,62.87 169.54,62.87 174.62,68.07 174.68,68.12 v174.68,68.89 174.62,68.81 v174.62,74.68 | 95.63,16.54 US3.1 95.22,16.38 | TK6.3 88.9,14.35 | v51.84,49.02 45.39,49.02 S5.1.3 S5.3 38.45,42.04 TK5.3 | 88.85,27.91 S6.1.3 | TKD4.3 TKD3.3 139.06,132.08 | US0.1 166.34,95.22 164.29,95.22 163.73,95.78 161.39,95.78 160.83,95.22 159.03,95.22 US0.1.1 | 162.51,85.75 162.56,85.8 S0.3 | 162.51,85.75 156.26,85.75 154.99,87.02 154.99,88.88 S0.1.3 154.84,88.88 151.18,88.88 TKD0.3 150.77,88.88 v133.07,88.88 | TK0.3 170.94,87.38 169.29,85.72 167.84,85.75 162.51,85.75 | v135.03,132.08 139.06,132.08 | v24.11,58.27 25.35,58.27 34.29,58.29 34.88,57.74 P1.B | v24.11,80.59 v16.54,80.59 | 20.32,97.13 13.56,97.13 12.19,95.76 TK4.3 | 20.32,97.13 26.82,97.13 27.94,96.01 S4.1.3 28.17,93.9 31.83,93.9 TKD2.3 | v32,97.16 32.11,97.21 51.13,97.21 v51.16,97.18 v54.48,97.18 v58.98,97.18 | US1.1 87.66,166.62 87.66,168.02 88.29,168.66 93.24,168.66 93.88,169.29 93.88,170.69 TK2.3 | v53.24,119.23 v53.24,113.21 | v53.24,119.23 50.57,119.23 I2C03.2 | v53.24,119.23 55.93,119.23 I2C02.2 | 60.58,119.23 56.08,119.23 I2C02.2 | 80.06,120.65 85.88,120.65 | 85.88,120.65 97.26,120.65 | 97.26,120.65 99.75,120.65 100.36,120.04 JP1.9 | 85.88,120.65 v85.75,120.67 | 97.26,120.65 97.13,120.67 | 60.58,119.23 69.09,119.23 70.81,120.83 79.88,120.83 80.01,120.65 80.06,120.65 | JP1.1 80.01,120.57 80.06,120.65 | 60.58,119.23 I2C01.2 | 94.28,150.65 TKD1.3 96.39,150.62 97.13,149.88 v97.13,147.22 97.18,147.22 | v135.03,127.81 133.99,126.77 133.88,126.77 133.6,126.75 97.13,126.77 v97.13,126.8 | 85.75,14.45 v85.5,14.38 82.4,14.38 81.53,15.24 J1.2
  Bottom 0.61: JP2.10 102.87,66.67 101.98,67.56 83.31,67.56 82.55,66.8 JP2.2 | v81.61,53.16 62.38,53.16 v61.87,52.78 | US3.1.1 v98.65,24.13 | v76.71,33.91 v83.69,33.91 | v96.52,52.2 89.66,52.2 87.38,49.91 v83.31,49.91 | S4.3 20.32,97.13 | I2C02.2 53.26,119.25 v53.24,119.23 | S1.1.3 140.31,132.11 139.06,132.08 | TK3.3 42.04,144.44 S3.3 S3.1.3 47.46,139.1 48.39,138.18 48.39,135 46.86,133.48 46.86,128.57 v46.89,128.55 | TK7.3 140.84,38.45 S7.1.3 142.01,37.24 136.75,42.57
  Bottom 0.813: v59.03,52.78 v61.87,52.78 | S7.3 136.74,42.56 136.75,42.57
  Bottom 1.016: 85.34,14.35 85.75,14.45 | v132.82,38.51 136.75,42.57
  Bottom 1.27: v98.63,16.54 95.63,16.54 | 85.34,14.35 88.9,14.35 94.59,14.35 95.22,15.11 95.22,16.38 | v76.71,27.94 88.85,27.91 | v76.71,33.91 74.93,35.69 66.17,35.69 v63.25,38.61 | v120.02,24.13 v98.65,24.13 98.65,24.11
  Bottom 1.676: JP3.10 JP3.9
AD0  (via drill 0.6, 0.61)
  Top 0.254: U2.36 92.94,50.09 93.88,51.03 93.88,51.77 U1.36
  Top 0.406: S10.P$4 124.36,78.03 124.36,75.72 123.06,74.42 123.06,70.23 124.33,68.96 v124.36,67.77 124.36,65.73 S10.P$3 124.45,65.16 124.46,64.9 v124.46,56.64 | v130.45,67.77 130.45,64.82 R_S2.2 | v143.87,67.77 143.87,64.82 R_S1.1 | U1.36 93.86,53.35 v95.12,57.02
  Bottom 0.406: v124.36,67.77 v130.45,67.77 v143.87,67.77 | v95.12,57.02 101.09,57.02 101.47,56.64 v124.46,56.64
AD1  (via drill 0.6)
  Top 0.254: U2.37 92.44,50.45 93.07,51.08 U1.37
  Top 0.406: US0.2 165.1,92.71 164.47,93.34 164.47,97.66 v163.7,98.42 | v148.08,98.42 v148.08,91.44 TKD0.2 | US0.1.2 157.48,92.71 156.84,93.34 v156.84,98.42 | U1.37 93.06,53.69 v93.34,55.75 | v106.93,55.24 106.93,59.94 105.16,61.72 105.16,84.84 104.78,85.22 v104.78,90.3
  Bottom 0.406: v163.7,98.42 v156.84,98.42 v148.08,98.42 | v93.34,55.75 95.63,55.75 95.89,56.01 100.58,56.01 101.35,55.24 v106.93,55.24 | v104.78,90.3 133.6,90.3 133.99,90.04 146.69,90.04 v148.08,91.44
AD2  (via drill 0.6)
  Top 0.254: U2.38 91.94,50.77 92.25,51.08 U1.38
  Top 0.406: US1.1.2 90.17,157.48 89.53,156.84 85.98,156.84 | US1.2 90.17,168.02 89.79,168.4 86.11,168.4 85.6,167.89 85.6,163.58 85.98,163.19 85.98,161.93 85.72,161.67 85.72,157.1 85.98,156.84 | 85.98,156.84 v85.98,148.21 88.39,145.8 88.39,125.22 88.77,124.84 v88.77,123.06 | v68.71,123.06 68.71,95.12 68.07,94.49 68.07,62.36 v68.45,61.98 | v91.95,56.64 92.25,54.51 92.25,51.87 U1.38
  Bottom 0.406: TKD1.2 91.44,148.84 90.81,148.21 v85.98,148.21 | v88.77,123.06 v68.71,123.06 | v68.45,61.98 69.22,61.98 71.25,59.94 84.58,59.94 85.09,59.44 88.01,59.44 90.81,56.64 v91.95,56.64
AD3  (via drill 0.6, 0.61)
  Top 0.254: U2.39 91.44,51.77 U1.39 | 24.38,90.22 24.18,90.22 US2.1.2
  Top 0.406: U1.39 91.46,54.08 91.44,54.23 90.68,56.26 90.04,56.9 v88.52,56.9 | TKD2.2 34.29,91.44 34.92,90.81 v34.92,86.84 v34.92,67.06 | v27.64,86.84 26.8,86.87 26.01,87.66 26.01,89.59 25.38,90.22 24.38,90.22 | v20.34,86.84 21.59,86.87 22.2,87.48 22.2,89.59 22.84,90.22 23.98,90.22 US2.1.2 | v41.02,55.37 v41.02,67.06
  Bottom 0.406: v88.52,56.9 87.38,56.9 85.85,55.37 v41.02,55.37 | v27.64,86.84 27.66,86.84 27.69,86.87 v34.92,86.84 | v20.34,86.84 19.28,86.84 18.36,87.76 18.34,89.53 17.68,90.19 US2.2 | v41.02,67.06 v34.92,67.06
AD4  (via drill 0.6)
  Top 0.254: U2.40 90.94,50.79 90.68,51.05 90.68,51.77 U1.40
  Top 0.406: U1.40 90.66,53.74 v89.53,55.63 | v106.93,53.59 106.68,53.34 v106.68,27.43 | TKD3.2 147.7,129.54 148.21,130.05 148.21,133.86 149.61,135.25 v164.97,135.25 | v176.28,115.95 v176.28,95.89
  Bottom 0.406: v89.53,55.63 90.68,54.48 95.76,54.48 96.39,55.12 99.95,55.12 100.84,54.23 106.3,54.23 v106.93,53.59 132.84,53.59 135.64,56.39 166.37,56.39 176.91,67.31 176.91,86.74 174.24,89.41 174.24,93.85 v176.28,95.89 | v106.68,27.43 96.39,27.43 95,26.04 93.22,26.04 92.71,25.53 US3.1.2 92.71,22.86 93.34,22.23 95,22.23 95.89,21.34 95.89,19.3 95,18.41 93.22,18.41 92.71,17.91 US3.2 | v164.97,135.25 v176.28,115.95
AD5  (via drill 0.6)
  Top 0.254: U2.41 90.44,50.4 89.86,50.98 U1.41
  Top 0.406: U1.41 89.86,53.4 89.53,53.85 88.14,55.37 v87.63,55.37
  Bottom 0.406: v87.63,55.37 86.74,54.48 42.29,54.48 40.01,52.2 33.15,52.2 32.38,52.96 P1.C
AGND  (via drill 0.61, 0.8)
  Top 0.254: U2.43 89.44,49.78 88.24,50.98 88.24,51.77 U1.43
  Top 0.406: 64.59,26.29 NM2.1 | U1.43 88.26,52.61 87.63,53.21 85.22,53.21 84.2,54.23 84.2,56.13 84.71,56.64 C1.1
  Top 0.61: v85.6,58.17 C1.1
  Top 0.813: v68.2,56.64 68.2,53.47 66.17,51.44 66.17,29.18 64.59,27.61 64.59,26.29
  Bottom 0.813: v68.2,56.64 84.07,56.64 v85.6,58.17
AREF
  Top 0.254: U2.42 89.94,50.09 89.05,50.98 89.05,51.78 U1.42
  Top 0.406: U1.42 89.06,53.05 88.01,54.1 86.36,54.1 C1.2
AVC  (via drill 0.6, 0.61)
  Top 0.254: U2.44 88.62,49.25 87.43,50.44 87.43,51.75 U1.44 | U2.24 95.22,43.97 96.39,42.8 97.25,42.8 U1.24
  Top 0.406: v85.78,51.89 87.38,51.89 U1.44 | U1.24 97.88,42.79 99.06,42.29 103.63,42.29 v104.39,43.05
  Top 0.61: L1.1 78.74,36.53 C6.1 79.88,39.75 80.64,40.51 v80.64,42.42
  Bottom 0.406: v85.78,51.89 85.09,51.18 82.8,51.18 82.04,50.42 82.04,46.74 79.88,44.58 79.88,43.18 v80.64,42.42 81.03,42.8 104.14,42.8 v104.39,43.05
BCHRG  (via drill 0.6)
  Top 0.406: v108.33,73.66 108.33,72.01 113.54,66.8 113.54,58.42 112.27,57.15 112.27,53.06 RN3.4 RN3.3 113.03,53.02 | v55.37,74.55 55.37,76.83 53.34,78.87 IC1.23 53.34,80.14
  Bottom 0.406: v108.33,73.66 107.44,74.55 v55.37,74.55
BON  (via drill 0.6)
  Top 0.406: IC1.22 52.07,78.23 v54.1,76.2 | v108.33,75.56 109.6,74.3 109.6,72.26 114.43,67.44 114.43,57.78 113.79,57.15 113.79,53.15 RN3.2 RN3.1 114.68,53.07
  Bottom 0.406: v54.1,76.2 55.75,76.2 56.39,75.56 v108.33,75.56
CHRG
  Top 0.406: RN3.6 113.03,51.38 JP3.2
D+  (via drill 0.6)
  Top 0.254: U2.4 87.14,46.97 86.61,47.5 85.75,47.5 U1.4
  Top 0.406: U1.4 84.37,47.59 v80.77,47.93 | v47.7,39.5 47.7,36.3 RN1.4
  Bottom 0.406: v80.77,47.93 72.31,47.93 70.48,46.1 66.04,46.1 65.02,47.12 60.2,47.12 58.42,45.34 52.83,39.62 v47.7,39.5
D-  (via drill 0.6)
  Top 0.254: U2.3 87.4,47.47 86.49,48.39 U1.3
  Top 0.406: U1.3 84.96,48.39 84.71,48.39 84.2,48.39 v80.72,49.45 | v50.11,40.77 50.11,36.3 RN1.1
  Bottom 0.406: v50.11,40.77 52.58,40.77 57.91,46.23 59.69,48.01 65.53,48.01 66.55,46.99 69.98,46.99 72.44,49.45 v80.72,49.45
DIO4  (via drill 0.6)
  Top 0.254: U1.25 97.23,43.56 96.39,43.56 95.48,44.47 U2.25
  Top 0.406: U1.25 97.89,43.59 99.06,43.18 102.87,43.18 v104.39,44.7 | v116.2,47.75 116.2,56.77 115.32,57.66 115.32,68.07 110.62,72.77 110.62,75.18 108.33,77.47 v108.33,93.47 | v56.26,91.44 54.86,91.44 54.61,91.19 IC1.1
  Bottom 0.406: v104.39,44.7 107.44,47.75 v116.2,47.75 | v108.33,93.47 107.82,93.6 71.25,93.6 70.23,92.58 66.17,92.58 65.02,91.44 v56.26,91.44
DIO5/BUZZ  (via drill 0.6)
  Top 0.254: U2.31 95.48,47.47 96.39,48.39 U1.31
  Top 0.406: U1.31 98.55,48.39 v99.95,48.77 | v109.09,49.91 109.09,51.82 108.2,52.7 108.2,60.07 106.05,62.23 106.05,85.34 105.79,85.6 105.79,87.12 106.05,87.38 v106.05,104.39 | v117.09,104.39 R4.2
  Bottom 0.406: v99.95,48.77 105.41,48.77 106.55,49.91 v109.09,49.91 | v106.05,104.39 v117.09,104.39
DIO6/TKD4  (via drill 0.6)
  Top 0.254: U1.27 97.23,45.21 96.27,45.21 96,45.47 U2.27
  Top 0.406: U1.27 98.83,45.19 99.06,44.96 101.6,44.96 103.76,47.12 103.76,56.01 103.5,56.26 v103.5,57.91 | v69.34,63.37 v69.34,93.85 | v43.18,93.85 IC1.10 | v116.97,57.91 116.2,58.67 116.2,68.71 111.63,73.28 111.63,75.69 109.35,77.98 109.35,92.58 109.73,92.96 109.73,94.23 108.08,95.89 108.08,102.87 108.46,103.25 108.46,105.28 106.3,107.44 106.3,122.17 106.68,122.56 v106.68,124.33
  Bottom 0.406: 152.4,129.64 TKD4.2 150.11,129.54 148.97,128.4 148.97,126.75 147.19,124.97 135.25,124.97 134.62,124.33 v106.68,124.33 | v69.34,63.37 71.88,60.83 85.09,60.83 85.6,60.33 88.52,60.33 90.55,58.29 101.35,58.29 101.73,57.91 v103.5,57.91 v116.97,57.91 | v69.34,93.85 v43.18,93.85
DIO7/RST_LCD  (via drill 0.61)
  Top 0.254: U1.1 85.73,49.91 87,49.91 88.17,48.74 U2.1
  Top 0.406: v86.56,112.85 86.97,112.45 86.97,72.47 85.65,71.14 85.65,67.54 85.06,66.95 85.06,65.02 JP2.3 85.09,62.99 82.8,60.71 82.8,52.32 85.14,49.99 U1.1 | v97.81,112.98 97.81,117.86 JP1.8
  Bottom 0.406: v86.56,112.85 88.04,112.85 88.44,113.26 94.16,113.26 94.44,112.98 v97.81,112.98
DIO8/CARD_CS  (via drill 0.6)
  Top 0.254: U2.28 97.25,45.97 U1.28
  Top 0.406: JP1.6 92.66,117.86 92.66,115.29 90.47,112.98 90.42,70.61 90.42,66.8 90.22,66.6 90.22,65.02 JP2.5 v90.17,60.45 | U1.28 98.41,45.99 99.19,45.85 101.22,45.85 102.87,47.5 102.87,55.24 102.36,55.75 v102.36,59.18
  Bottom 0.406: v102.36,59.18 91.44,59.18 v90.17,60.45
DIO9/LCD_CS  (via drill 0.6, 0.61)
  Top 0.254: U2.29 96,46.47 96.27,46.74 97.21,46.74 U1.29
  Top 0.406: v92.66,68.86 92.66,65.02 JP2.6 v92.71,60.45 | v89.13,68.86 89.53,69.14 89.53,113.51 90.22,114.2 90.22,117.86 JP1.5 | U1.29 98.76,46.79 99.06,46.74 100.84,46.74 101.98,47.88 101.98,54.48 101.47,54.99 101.47,58.29 101.17,58.6 v101.17,60.45
  Bottom 0.406: v89.13,68.86 v92.66,68.86 | v101.17,60.45 v92.71,60.45
DIO10/DC_LCD  (via drill 0.6, 0.61)
  Top 0.254: U2.30 95.74,46.97 96.39,47.62 97.22,47.62 U1.30
  Top 0.406: v87.38,114.2 87.78,113.79 87.78,71.81 86.72,70.74 86.72,67.51 87.66,66.57 87.66,65.15 JP2.4 | v95.1,114.2 95.1,117.86 JP1.7 | U1.30 98.72,47.59 98.93,47.62 100.46,47.62 101.09,48.26 101.09,53.85 100.58,54.36 100.58,57.78 99.95,58.42 v99.95,61.59 | v87.63,61.59 JP2.4 | 87.63,64.9 JP2.4
  Bottom 0.406: v95.1,114.2 v87.38,114.2 | v99.95,61.59 v87.63,61.59
DIO11  (via drill 0.6)
  Top 0.254: U1.12 87.43,40.22 87.43,41.43 88.7,42.7 U2.12
  Top 0.279: 87.5,40.23 U1.12
  Top 0.406: IC1.11 v41.91,95.89 | v109.35,96.77 109.35,96.14 110.74,94.74 110.74,92.46 110.36,92.08 110.36,78.49 112.65,76.2 112.65,73.79 117.09,69.34 117.09,59.69 118.24,58.55 v118.24,51.18 | v107.82,51.18 107.82,35.69 v108.2,35.31 | v85.98,38.23 87.46,39.71 U1.12
  Bottom 0.406: v41.91,95.89 42.29,96.27 50.04,96.27 50.67,95.63 66.29,95.63 67.06,96.39 108.97,96.39 v109.35,96.77 | v118.24,51.18 v107.82,51.18 | v108.2,35.31 96.27,35.31 92.71,38.86 86.61,38.86 v85.98,38.23
DIO12/TKD5  (via drill 0.6)
  Top 0.254: U1.26 97.2,44.32 96.39,44.32 95.74,44.97 U2.26
  Top 0.406: U1.26 97.98,44.39 99.06,44.07 101.98,44.07 104.78,46.86 104.78,58.8 v104.39,59.18 | v112.27,59.18 112.65,59.56 112.65,66.17 107.06,71.75 v107.06,86.36 107.06,103.25 107.44,103.63 107.44,104.9 105.28,107.06 v105.28,123.06 | 41.91,80.14 IC1.14 v41.91,84.2
  Bottom 0.406: v104.39,59.18 v112.27,59.18 | v105.28,123.06 134.75,123.06 135.64,123.95 154.81,123.95 156.34,125.48 156.34,128.27 157.61,129.54 TKD5.2 | v41.91,84.2 47.24,84.2 49.4,86.36 v107.06,86.36
DIO13  (via drill 0.6)
  Top 0.254: U1.32 97.22,49.15 96.39,49.15 95.22,47.97 U2.32
  Top 0.406: IC1.13 v40.64,82.8 | v113.41,85.22 113.41,81.41 122.05,72.77 v122.05,52.45 | v99.95,50.29 98.3,49.2 97.3,49.2 U1.32
  Bottom 0.406: v40.64,82.8 42.42,82.8 42.8,83.19 47.75,83.19 49.78,85.22 v113.41,85.22 | v122.05,52.45 107.44,52.45 105.28,50.29 v99.95,50.29
GND  (via drill 0.6)
  Top 0.254: U1.15 89.86,41 90.44,41.57 U2.15 90.44,45.69 90.47,45.72 U2.EXP | U1.35 94.64,51.77 94.64,50.98 93.44,49.78 U2.35 93.42,48.98 93.42,47.95 93.6,47.78 93.6,43.76 | 96.11,41.96 97.23,41.96 U1.23 | 97.16,42.04 95.76,42.04 94.61,43.18 94.61,43.43 U2.23
  Top 0.279: U2.23 94.2,43.47 93.75,43.69 93.6,43.76 93.67,43.74 93.52,43.99
  Top 0.356: 45.01,155.19 45.01,152.83 | 57.07,105.97 57.07,104.14
  Top 0.381: 57.07,104.14 58.29,103.53
  Top 0.406: S7.2 139.81,42.82 142.75,39.88 | X1.2 90.55,31.88 X1.4 | U1.15 89.86,37.28 89.03,36.2 | 97.23,41.25 97.23,41.96 | 94.64,51.87 94.69,51.87 | 94.64,51.82 94.64,51.89 94.67,51.92 94.67,53.09 95.15,53.57
  Top 0.508: 43.18,81.66 43.18,78.11
  Top 0.61: 65.91,24.64 64.52,24.64 | 64.52,24.64 60.83,24.64 | 60.83,24.64 59.18,24.64 | 60.83,24.64 60.83,23.37 | 64.52,24.64 64.52,23.37
  Top 0.813: PTZ1.P$52 137.03,121.92 | 137.03,121.92 135.51,121.92 | 137.03,121.92 137.03,123.32 | PTZ2.P$52 21.08,121.92 | 101.47,154.94 PTZ4.P$52 101.6,156.34 | 101.6,155.07 99.95,155.07 | 50.67,155.07 50.8,155.07 50.8,156.34 | 50.67,154.94 49.53,154.94
  Top 1.016: 60.86,26.26 60.86,24.49 NM1.1 | 64.49,26.26 64.52,26.26 64.52,24.64 64.52,24.43
  Top 1.27: 118.11,45.72 JP3.5 118.11,40.26
  Bottom 1.27: 118.11,46.1 JP3.5
  other vias: 60.96,22.61 64.26,22.61 62.61,20.95 62.61,22.61 80.14,58.42 88.9,62.87 96.52,62.87 103.89,62.87
  pour Top (isolate 0.457, rank 2): -10.92,188.21 185.42,188.21 185.42,-1.02 -12.06,-6.6 -11.43,188.47
  pour Bottom (isolate 0.457, rank 2): -11.3,186.7 185.4,186.5 185.4,-1 -12.04,-1 -11.4,186.7
HWB
  Top 0.254: U2.33 94.72,48.74 96.01,50.04 97.21,50.04 U1.33
  Top 0.406: U1.33 97.26,51.16 97.79,51.69 R6.2
I14  (via drill 0.9 pad 1.42)
  Top 0.406: 44.45,80.14 IC1.16 44.45,77.98 42.04,75.56 41.15,75.56 40.64,75.06 v40.64,73.91
I15  (via drill 0.9 pad 1.42)
  Top 0.406: 45.72,80.39 IC1.17 45.72,77.6 43.18,75.06 v43.18,73.91
I16  (via drill 0.9 pad 1.42)
  Top 0.406: v45.72,73.91 45.72,75.82 46.99,77.09 IC1.18
I17  (via drill 0.9 pad 1.42)
  Top 0.406: v48.26,73.91 48.26,80.01 IC1.19 48.26,80.14
I18  (via drill 0.9 pad 1.42)
  Top 0.406: IC1.20 49.53,77.09 50.8,75.82 v50.8,73.91
I19  (via drill 0.9 pad 1.42)
  Top 0.406: IC1.21 50.8,77.47 53.34,74.93 v53.34,73.91
MISO  (via drill 0.61)
  Top 0.254: U2.11 88.17,43.21 86.87,41.91 85.74,41.91 U1.11
  Top 0.406: v81.66,17.75 81.66,22.73 82.04,23.11 82.04,32.26 81.53,32.77 81.53,34.8 83.49,36.75 83.49,37.92 v85.34,39.78 85.34,41.99 U1.11 | v83.72,92.33 83.72,98.27 84,98.55 84,114.61 82.53,116.08 JP1.2 | v99.29,92.33 98.75,91.8 98.75,67.87 100.38,66.24 100.38,65.02 JP2.9 100.38,64.62 100.38,63.07 103,60.45 104.9,60.45 105.66,59.69 105.66,36.58 105.54,36.45 v105.41,36.35
  Bottom 0.406: v81.66,17.75 77.22,17.75 J1.1 | v105.41,36.35 104.88,36.32 96.7,36.32 93.24,39.78 v85.34,39.78 | v83.72,92.33 83.87,92.35 98.5,92.35 v99.29,92.33
MOSI  (via drill 0.6, 0.61)
  Top 0.254: U2.10 87.66,43.97 86.49,42.8 85.67,42.8 U1.10
  Top 0.406: v95.22,70.08 95.22,64.77 JP2.7 | v87.94,70.08 87.96,70.1 87.96,70.16 88.65,70.74 88.59,114.73 87.66,115.67 87.66,117.98 JP1.4 | J1.4 74.24,15.16 74.24,13.89 74.88,13.26 77.7,13.26 78.61,14.17 78.61,18.92 76.33,21.21 76.33,22.61 75.06,23.88 72.9,23.88 72.03,24.74 v72.03,39.75 72.01,40.16 72.01,47.37 73.66,49.02 75.44,49.02 77.09,50.65 v77.09,70.1 | U1.10 84.7,42.79 83.69,41.78 v83.44,39.75
  Bottom 0.406: 88.24,70.08 v95.22,70.08 | v77.09,70.1 88.27,70.1 88.24,70.08 | v87.94,70.08 88.24,70.08 | v83.44,39.75 83.44,38.48 82.68,37.72 79.25,37.72 77.22,39.75 v72.03,39.75
N$2
  Top 0.406: R8.1 52.02,34.54 52.02,34.34 52.07,34.29 50.16,34.29 50.09,34.36 RN1.8 50.09,31.06 51.56,30.1 X2.2 51.61,30.07
N$3
  Top 0.406: 47.68,34.44 47.65,34.29 45.67,34.29 R7.1 | 47.68,34.44 47.68,30.25 47.7,30.23 50.39,28.45 X2.3 | 47.68,34.44 RN1.5
N$4
  Top 0.406: RN2.4 173.38,70.56 173.38,70.54 173.35,70.51 173.35,67.41 172.44,66.5 170.69,66.5 TX.A
N$5
  Top 0.381: IC4.4 56.28,101.75 R11.2
N$12  (via drill 0.61)
  Top 0.406: 52.43,36.58 R8.2 52.02,36.58 | 54.46,36.58 L2.1 | 45.52,36.58 R7.2 45.8,36.58 | X2.P$2 | 45.24,28.45 X2.P$1
  Top 0.61: 54.46,36.58 52.43,36.58 | 45.52,36.58 44.3,36.58 44.3,29.26 44.7,28.85 X2.P$1 | v52.02,38.08 52.02,36.58 | 45.8,36.58 v45.8,38.08
  Top 0.813: X2.P$2 50.19,25.4 45.24,28.45
  Bottom 0.61: v45.8,38.08 v52.02,38.08
N$13  (via drill 0.61)
  Top 0.406: v144.27,57.73 144.27,58.12 S11.P$2 | v130.05,57.73 130.05,58.12 S11.P$1 130.05,58.52 130.05,61.85 128.7,63.2 128.7,64.97 R_S2.1 128.7,65.08 128.7,68.5 130.18,69.98 130.18,75.82 128.65,77.34 R_S3.2
  Bottom 0.406: v130.05,57.73 v144.27,57.73
N$14
  Top 0.406: RN2.3 171.05,71.36 170.69,71.37 170.69,71.28 LED.A
N$17  (via drill 0.8)
  Top 0.406: v119.89,111.76 116.23,111.76 T1.3
  Bottom 0.406: SG1.- v119.89,111.76
N$24
  Top 0.406: RN2.1 173.25,73.03 173.25,75.82 172.47,76.61 170.81,76.61 PWR.A
N$27  (via drill 0.61)
  Top 0.406: R_S3.1 130.45,80.37 v130.45,82.93 130.43,82.96 130.43,85.24 S12.P$3 | R_S4.2 143.87,80.37 v143.87,82.8 143.89,83.21 143.89,85.24 S12.P$4
  Bottom 0.406: v143.87,82.8 141.35,82.8 139.06,80.52 135.13,80.52 132.72,82.93 v130.45,82.93
N$29  (via drill 0.6, 0.61)
  Top 0.406: S13.P$3 154.84,65.48 154.81,69.09 153.67,70.23 153.67,74.55 154.84,75.72 v154.84,77.39 154.84,79.68 S13.P$4 155.37,80.31 155.4,80.31 155.68,80.34 159.16,80.34 R_S5.2 | v145.62,77.39 145.62,80.21 R_S4.1
  Bottom 0.406: v154.84,77.39 v145.62,77.39
N$30  (via drill 0.61)
  Top 0.406: 139.8,65.23 139.8,65.53 139.83,68.96 138.3,70.61 138.3,74.17 139.8,75.67 139.8,79.5 | 139.19,65.53 139.7,65.53 | 139.8,65.43 139.7,65.53 | 139.7,65.53 S14.P$3 | v160.93,82.17 160.93,80.47 R_S5.1 | v141.83,79.5 141.83,79.53 141.81,79.5 139.8,79.5 | 139.8,79.5 S14.P$4
  Top 0.61: 139.8,65.43 139.8,65.53
  Bottom 0.406: v160.93,82.17 150.19,82.17 147.5,79.5 v141.83,79.5
N$31
  Top 0.406: T1.1 115.42,109.32 115.42,106.88 R4.1
ON
  Top 0.406: RN3.7 113.81,50.4 114.05,50.16 114.05,46.1 JP3.4
Q1
  Top 0.254: U2.17 91.44,40.21 U1.17
  Top 0.406: X1.1 C3.2 94.61,34.42 92.96,36.07 R5.2 92.33,36.83 91.46,37.7 U1.17
Q2
  Top 0.254: U2.16 90.94,41.31 90.68,41.05 90.68,40.2 U1.16
  Top 0.279: 90.68,40.13 90.68,40.26 90.66,40.24 U1.16
  Top 0.406: 90.55,34.16 R5.1 90.68,36.07 U1.16 | 90.55,34.16 90.55,33.91 C2.2 | X1.3 90.54,34.17 90.55,34.16
RESET  (via drill 0.6, 0.61)
  Top 0.254: U2.13 89.44,42.15 88.27,40.97
  Top 0.279: 88.27,40.97 U1.13
  Top 0.406: R3.2 61.77,56.08 62.87,56.08 63.25,56.49 63.65,56.9 65.02,56.9 D1.A 65.43,56.9 66.42,56.9 67.56,58.04 70,58.04 | 70,58.04 70,51.21 S8.1 70,50.8 v70,38.61 70,21.82 71.75,20.07 J1.5 | 70,58.04 70,59.33 S8.2 | U1.13 88.27,38.99 87,37.21 v85.98,36.45
  Bottom 0.406: v70,38.61 76.71,38.61 78.87,36.45 v85.98,36.45
RX  (via drill 0.6)
  Top 0.254: U2.20 92.94,41.83 93.88,40.89 93.88,40.2 U1.20
  Top 0.406: U1.20 93.86,39.06 95.45,37.47 v97.41,37.47 | v115.57,36.7 JP3.3
  Bottom 0.406: v97.41,37.47 104.14,37.47 104.39,37.72 106.05,37.72 107.06,36.7 v115.57,36.7
RX_LED  (via drill 0.6)
  Top 0.254: U2.8 87.14,44.97 86.49,44.32 85.72,44.32 U1.8
  Top 0.406: U1.8 84.14,44.39 v82.8,44.07 | v166.37,50.55 166.37,70.61 167.13,71.37 LED.C
  Bottom 0.406: v82.8,44.07 83.06,43.81 102.49,43.81 103.12,44.45 103.12,45.34 103.89,46.1 104.39,46.1 106.93,48.64 109.73,48.64 110.74,49.66 138.68,49.66 139.57,50.55 v166.37,50.55
SCK  (via drill 0.6, 0.61)
  Top 0.254: U2.9 87.4,44.47 86.49,43.56 85.69,43.56 U1.9
  Top 0.406: v97.81,97.61 97.81,65.02 JP2.8 97.81,64.75 97.81,61.8 99.03,60.58 99.03,57.94 99.57,57.4 99.67,57.25 99.67,52.6 arc90 v99.69,52.58 | v85.06,97.61 85.06,118.11 JP1.3 | J1.3 74.37,17.88 74.37,17.86 J1.3 | v74.3,21.84 J1.3 | U1.9 84.35,43.59 83.31,42.8 82.17,42.8 | v81.15,44.07 82.17,42.8 | 82.17,42.8 82.17,36.7 80.64,35.18 80.64,32.26 81.03,31.88 81.03,23.62 80.39,22.99 v80.39,21.84
  Bottom 0.406: v97.81,97.61 97.54,97.59 85.6,97.59 v85.06,97.61 | v99.69,52.58 97.66,50.55 97.66,45.85 96.65,44.83 84.07,44.83 83.57,45.34 82.17,45.34 v81.15,44.07 | v80.39,21.84 v74.3,21.84
SCL  (via drill 0.6)
  Top 0.254: U2.18 91.94,41.31 92.25,41 U1.18
  Top 0.279: 92.2,40.24 U1.18
  Top 0.381: IC4.10 60.56,108.48 v60.58,108.46
  Top 0.406: U1.18 92.26,38.3 95.25,35.31 96.14,35.31 97.16,34.29 v97.16,33.4 | v64.9,124.33 v64.9,108.46 64.9,90.3 64.39,89.79 v64.39,60.96 | v57.66,60.96 57.66,57.91 | 57.66,57.91 v57.66,51.44 55.37,51.44 54.61,50.67 R10.2 | v67.69,50.8 v67.69,37.34 | U3.6 57.66,57.91
  Bottom 0.381: v60.58,108.46 v64.9,108.46
  Bottom 0.406: v64.9,124.33 I2C01.4 I2C02.4 I2C03.4 | v64.39,60.96 v57.66,60.96 | v57.66,51.44 67.06,51.44 v67.69,50.8 | v67.69,37.34 76.33,37.34 78.49,35.18 86.49,35.18 88.39,37.08 91.44,37.08 95.12,33.4 v97.16,33.4
SDA  (via drill 0.6)
  Top 0.254: U2.19 92.44,41.57 93.07,40.95 U1.19
  Top 0.279: 92.96,40.28 U1.19
  Top 0.381: IC4.7 60.55,106.08 v60.58,106.05
  Top 0.406: U1.19 93.06,38.74 95.43,36.37 96.6,36.37 98.68,34.29 v98.68,33.4 | v66.29,121.79 v66.29,106.05 66.29,96.01 65.91,95.63 65.91,89.79 65.53,89.41 v65.53,59.82 | v68.83,49.15 v68.83,33.91 | R9.1 v56.39,52.96 v56.39,56.64 U3.5
  Bottom 0.381: v60.58,106.05 v66.29,106.05
  Bottom 0.406: I2C03.3 I2C02.3 I2C01.3 v66.29,121.79 | v65.53,59.82 65.53,57.53 64.77,56.64 v56.39,56.64 | v56.39,52.96 56.39,50.8 57.02,50.16 66.17,50.16 67.18,49.15 v68.83,49.15 | v68.83,33.91 74.68,33.91 76.07,32.51 85.34,32.51 88.9,36.07 90.81,36.07 94.74,32.13 98.17,32.13 98.68,32.64 v98.68,33.4
TX  (via drill 0.6)
  Top 0.254: U2.21 93.44,42.17 94.64,40.97 94.64,40.21 U1.21
  Top 0.406: U1.21 94.66,39.4 95.45,38.61 98.42,38.61 v98.68,38.73 | v113.03,37.97 JP3.1
  Bottom 0.406: v98.68,38.73 103.89,38.73 104.14,38.99 106.55,38.99 107.57,37.97 v113.03,37.97
TX_LED  (via drill 0.6, 0.61)
  Top 0.254: U2.22 94.18,42.7 95.45,41.43 U1.22
  Top 0.279: 95.5,40.01 95.5,40.14 U1.22
  Top 0.406: v168.5,64.16 168.5,65.84 TX.C | v97.41,39.83 95.56,39.83 95.5,40.01 | v109.6,60.58 109.22,60.2 109.22,53.21 110.36,52.07 110.36,49.28 109.09,48.01 v109.09,39.62
  Bottom 0.406: v168.5,64.16 146.43,64.14 135.76,64.14 132.18,60.55 109.8,60.55 v109.6,60.58 | v97.41,39.83 97.48,39.83 97.66,40.01 108.71,40.01 v109.09,39.62
UCAP
  Top 0.254: U2.6 85.67,45.97 U1.6
  Top 0.406: U1.6 78.37,45.99 C5.1
UGND  (via drill 0.61, 0.8)
  Top 0.254: U2.5 86.88,46.47 86.61,46.74 85.71,46.74 U1.5
  Top 0.406: 60.81,26.42 NM1.2 60.78,26.42 60.71,26.42 60.3,26.31 | U1.5 80.09,46.79 79.25,47.37 77.98,47.37 76.96,46.35 C5.2
  Top 0.61: v75.44,45.97 C5.2 | L2.2 v54.61,32.77
  Top 0.813: v62.99,32.77 62.99,30.99 61.98,29.97 61.98,28.7 60.81,27.53 60.81,26.42 | 60.3,26.31 53.85,26.31 X2.4
  Bottom 0.61: v54.61,32.77 v62.99,32.77
  Bottom 0.813: v75.44,45.97 73.41,45.97 71.37,43.94 60.4,43.97 60.43,43.97 60.45,43.94 | v62.99,32.77 62.99,34.54 58.55,38.99 58.55,42.16 60.33,43.94 60.45,43.94 | 60.45,43.94 61.98,43.94
VP1
  Top 1.016: SJ1.2 81.28,129.54
VP2
  Top 0.406: 98.75,129.51 SJ2.2 | 101.58,129.51 PTZ4.P$42
  Top 1.016: 101.58,129.51 98.75,129.51
VP3
  Top 0.406: 134.11,101.58 SJ3.2 | 137.36,101.58 PTZ1.P$42
  Top 1.016: 137.36,101.58 134.11,101.58
VP4
  Top 0.406: 22.76,101.19 PTZ2.P$42
  Top 1.016: SJ4.2 45.72,101.6
VUSB  (via drill 0.6, 0.8)
  Top 0.254: U2.7 86.88,45.47 86.61,45.21 85.69,45.21 U1.7
  Top 0.406: U1.7 80.49,45.19 78.74,43.94 C9.1 | 61.47,41.4 SJ5.1
  Top 0.61: 54.74,43.59 C8.+ 54.89,43.59 | C9.1 v78.74,41.4
  Top 0.813: v60.07,41.4 61.47,41.4
  Top 1.27: v60.07,41.4 C7.+ 54.89,43.59 | JP3.7 JP3.8
  Bottom 1.27: v60.07,41.4 v78.74,41.4 79.5,40.64 81.79,40.64 82.55,41.4 110.11,41.4 112.01,39.62 119.89,39.62 120.52,40.39 120.65,40.51 JP3.8
  pour Top (isolate 0.406, no thermals): 53.21,44.07 53.21,42.67 57.28,38.61 57.28,36.83 60.83,36.83 60.83,43.05 60.07,44.07
X0  (via drill 0.61)
  Top 0.406: v44.42,95.02 44.42,90.22 IC1.9 | v172.77,97.13 173.53,96.34 173.53,92.08 172.9,91.44 TK0.2 | v154.97,97.13 154.97,94 S0.1.1 | S0.1 v162.56,97.13
  Bottom 0.406: v44.42,95.02 44.7,94.74 66.93,94.74 67.67,95.48 67.79,95.5 152.27,95.5 153.77,94 154.91,94 S0.1.1 | v172.77,97.13 v162.56,97.13 v154.97,97.13
X1  (via drill 0.61)
  Top 0.406: v45.8,92.66 45.8,90.22 IC1.8 | v63.63,125.6 63.63,107.06 v63.65,92.66 | v138.05,126.34 138.05,134.11 135.38,136.78 135.38,139.13 S1.1.1
  Bottom 0.406: v63.65,92.66 v45.8,92.66 | v63.63,125.6 83.59,125.6 84.12,125.58 134.49,125.6 135.25,126.36 137.92,126.36 138.02,126.47 v138.05,126.34 | TK1.2 146.56,146.56 143,146.56 S1.1 136.78,140.34 S1.1.1
X2  (via drill 0.61)
  Top 0.406: 88.88,154.84 S2.1.1 | v84.68,173.13 v84.68,162.56 v84.68,154.84 84.71,154.81 84.71,147.57 87.38,144.91 v87.38,124.36 | v67.51,124.38 67.56,95.63 66.88,94.94 66.88,88.98 66.86,88.96 v66.85,88.85 | v46.99,87.63 IC1.7
  Bottom 0.254: 88.59,154.84 88.8,154.84 S2.1.1
  Bottom 0.406: v84.68,173.13 90.81,173.13 91.44,172.49 TK2.2 | v46.99,87.63 48.18,88.85 v66.85,88.85 | v87.38,124.36 86.97,124.38 v67.51,124.38 | 88.59,154.84 v84.68,154.84 | S2.1 v84.68,162.56
X3  (via drill 0.6)
  Top 0.406: IC1.6 v48.26,98.55 | v43.81,131.09 43.79,135.41 S3.1.1
  Bottom 0.406: v48.26,98.55 48.13,124.21 46.99,125.35 45.72,125.35 43.81,127.25 v43.81,131.09 | TK3.2 36.7,146.18 36.7,142.62 S3.1 S3.1.1
X4  (via drill 0.61)
  Top 0.254: 49.58,89.81 49.58,90.07 IC1.5
  Top 0.406: v49.58,87.63 49.58,89.81 | v9.78,85.47 9.75,90.81 10.39,91.44 TK4.2
  Bottom 0.254: 20.45,88.88 20.34,88.88 S4.1
  Bottom 0.406: 26.04,85.47 26.01,85.57 26.01,85.5 26.04,85.47 | 26.04,85.47 26.04,88.27 26.67,88.9 S4.1.1 | 22.02,85.5 21.95,85.57 21.95,88.37 21.44,88.88 20.45,88.88 | v49.58,87.63 48.84,87.63 46.74,85.47 26.04,85.47 | 22.05,85.47 26.04,85.47 | 21.87,85.47 v9.78,85.47 | 22.02,85.5 21.87,85.47 | 22.05,85.47 22.02,85.5 | 22.05,85.47 21.87,85.47
X5  (via drill 0.6, 0.61)
  Top 0.406: v50.8,83.95 IC1.4 | v44.7,70.51 44.7,51.18 47.37,48.51 47.37,43.81 S5.1.1 | v37.72,81.53 v37.72,70.51
  Bottom 0.406: S5.1.1 S5.1 40.39,36.7 36.83,36.7 TK5.2 | v50.8,83.95 50.04,83.95 48.13,82.17 43.31,82.17 42.55,81.53 v37.72,81.53 | v37.72,70.51 v44.7,70.51
X6  (via drill 0.61)  (1 unrouted)
  Top 0.406: 93.88,20.32 S6.1 97.03,20.32 | v53.03,84 52.07,85.01 IC1.3 52.02,89.81 | v66.85,84 66.83,83.84 66.83,62.53 66.85,62.64 v66.85,62.56 | 78.38,58.73 v78.36,58.75 78.11,58.5 78.11,50.16 75.95,48.01 74.17,48.01 73.05,46.89 73.05,40.74 73.28,40.51 v73.3,29.67 | 97.13,20.45 97.13,26.31 95.5,27.94 S6.1.1 | 97.13,20.45 97.13,20.3 | 97.13,20.3 v97.13,9.75 | 97.03,20.32 97.13,20.45 | 97.13,20.3 97.03,20.32
  Bottom 0.406: v53.03,84 53.44,84.02 66.57,84.02 v66.85,84 | v66.85,62.56 66.85,61.54 67.69,60.71 68.96,60.71 69.72,59.94 70.94,58.78 77.95,58.78 v78.36,58.75 | v73.3,29.67 93.42,29.67 94,29.08 94,27.91 | v97.13,9.75 92.08,9.75 91.44,10.39 TK6.2
X7  (via drill 0.6, 0.61)
  Top 0.406: v53.37,87.63 53.37,89.81 IC1.2 | v143.92,75.54 143.92,70.51 141.6,68.2 141.6,47.37 S7.1 | v63.12,76.83 63.12,87.38 v63.17,87.63
  Bottom 0.406: S7.1 S7.1.1 146.56,39.88 146.56,36.32 TK7.2 | v63.17,87.63 v53.37,87.63 | v143.92,75.54 137.03,75.56 113.92,75.56 112.65,76.83 v63.12,76.83
XUSB  (via drill 0.8)
  Top 0.406: 59.05,33.33 F1.1
  Top 1.27: 59.05,33.33 v59.05,30.25
  Bottom 0.406: 53.8,28.85 X2.1
  Bottom 1.27: v59.05,30.25 57.76,28.98 57.53,28.83 53.8,28.85

## Text on the board
Bottom: Rev-5
tNames: www.arduino.cc | www.complubot.org | ARDUINO ROBOT | Prototype Edition | I14 | I16 | I18 | I15 | I17 | I19 | CONTROL BOARD | v0006 alpha | RESET | RESET | SCK | MISO | 1 | 2 | GND | +5V | MOSI
tValues: SCL | SDA | +5V | GND | I2C